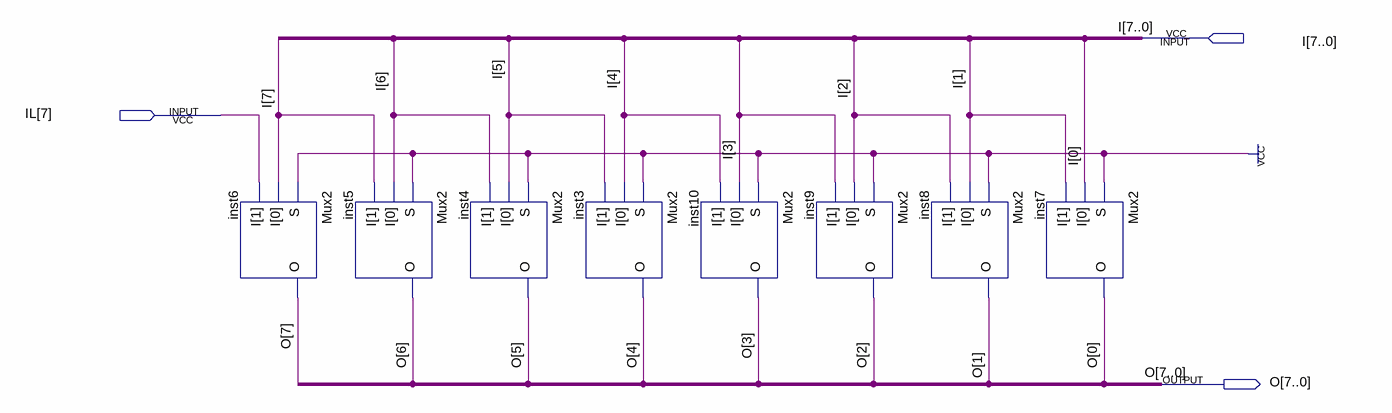
[diagram p0: schematic sheet]
// Quartus schematic ShiftRight1bit.bdf as structural Verilog: 8 symbols, 3 pins
module ShiftRight1bit (
  input  [7:0] I,
  input  [7:7] IL,
  output [7:0] O
);

  Mux2 inst6 (.S(1'b1), .I({IL[7], I[7]}), .O(O[7]));
  Mux2 inst5 (.S(1'b1), .I(I[7:6]), .O(O[6]));
  Mux2 inst4 (.S(1'b1), .I(I[6:5]), .O(O[5]));
  Mux2 inst3 (.S(1'b1), .I(I[5:4]), .O(O[4]));
  Mux2 inst10 (.S(1'b1), .I(I[4:3]), .O(O[3]));
  Mux2 inst9 (.S(1'b1), .I(I[3:2]), .O(O[2]));
  Mux2 inst8 (.S(1'b1), .I(I[2:1]), .O(O[1]));
  Mux2 inst7 (.S(1'b1), .I(I[1:0]), .O(O[0]));
endmodule
